# EAGLE design two_pieceboard_1 (EAGLE 7.6.0)
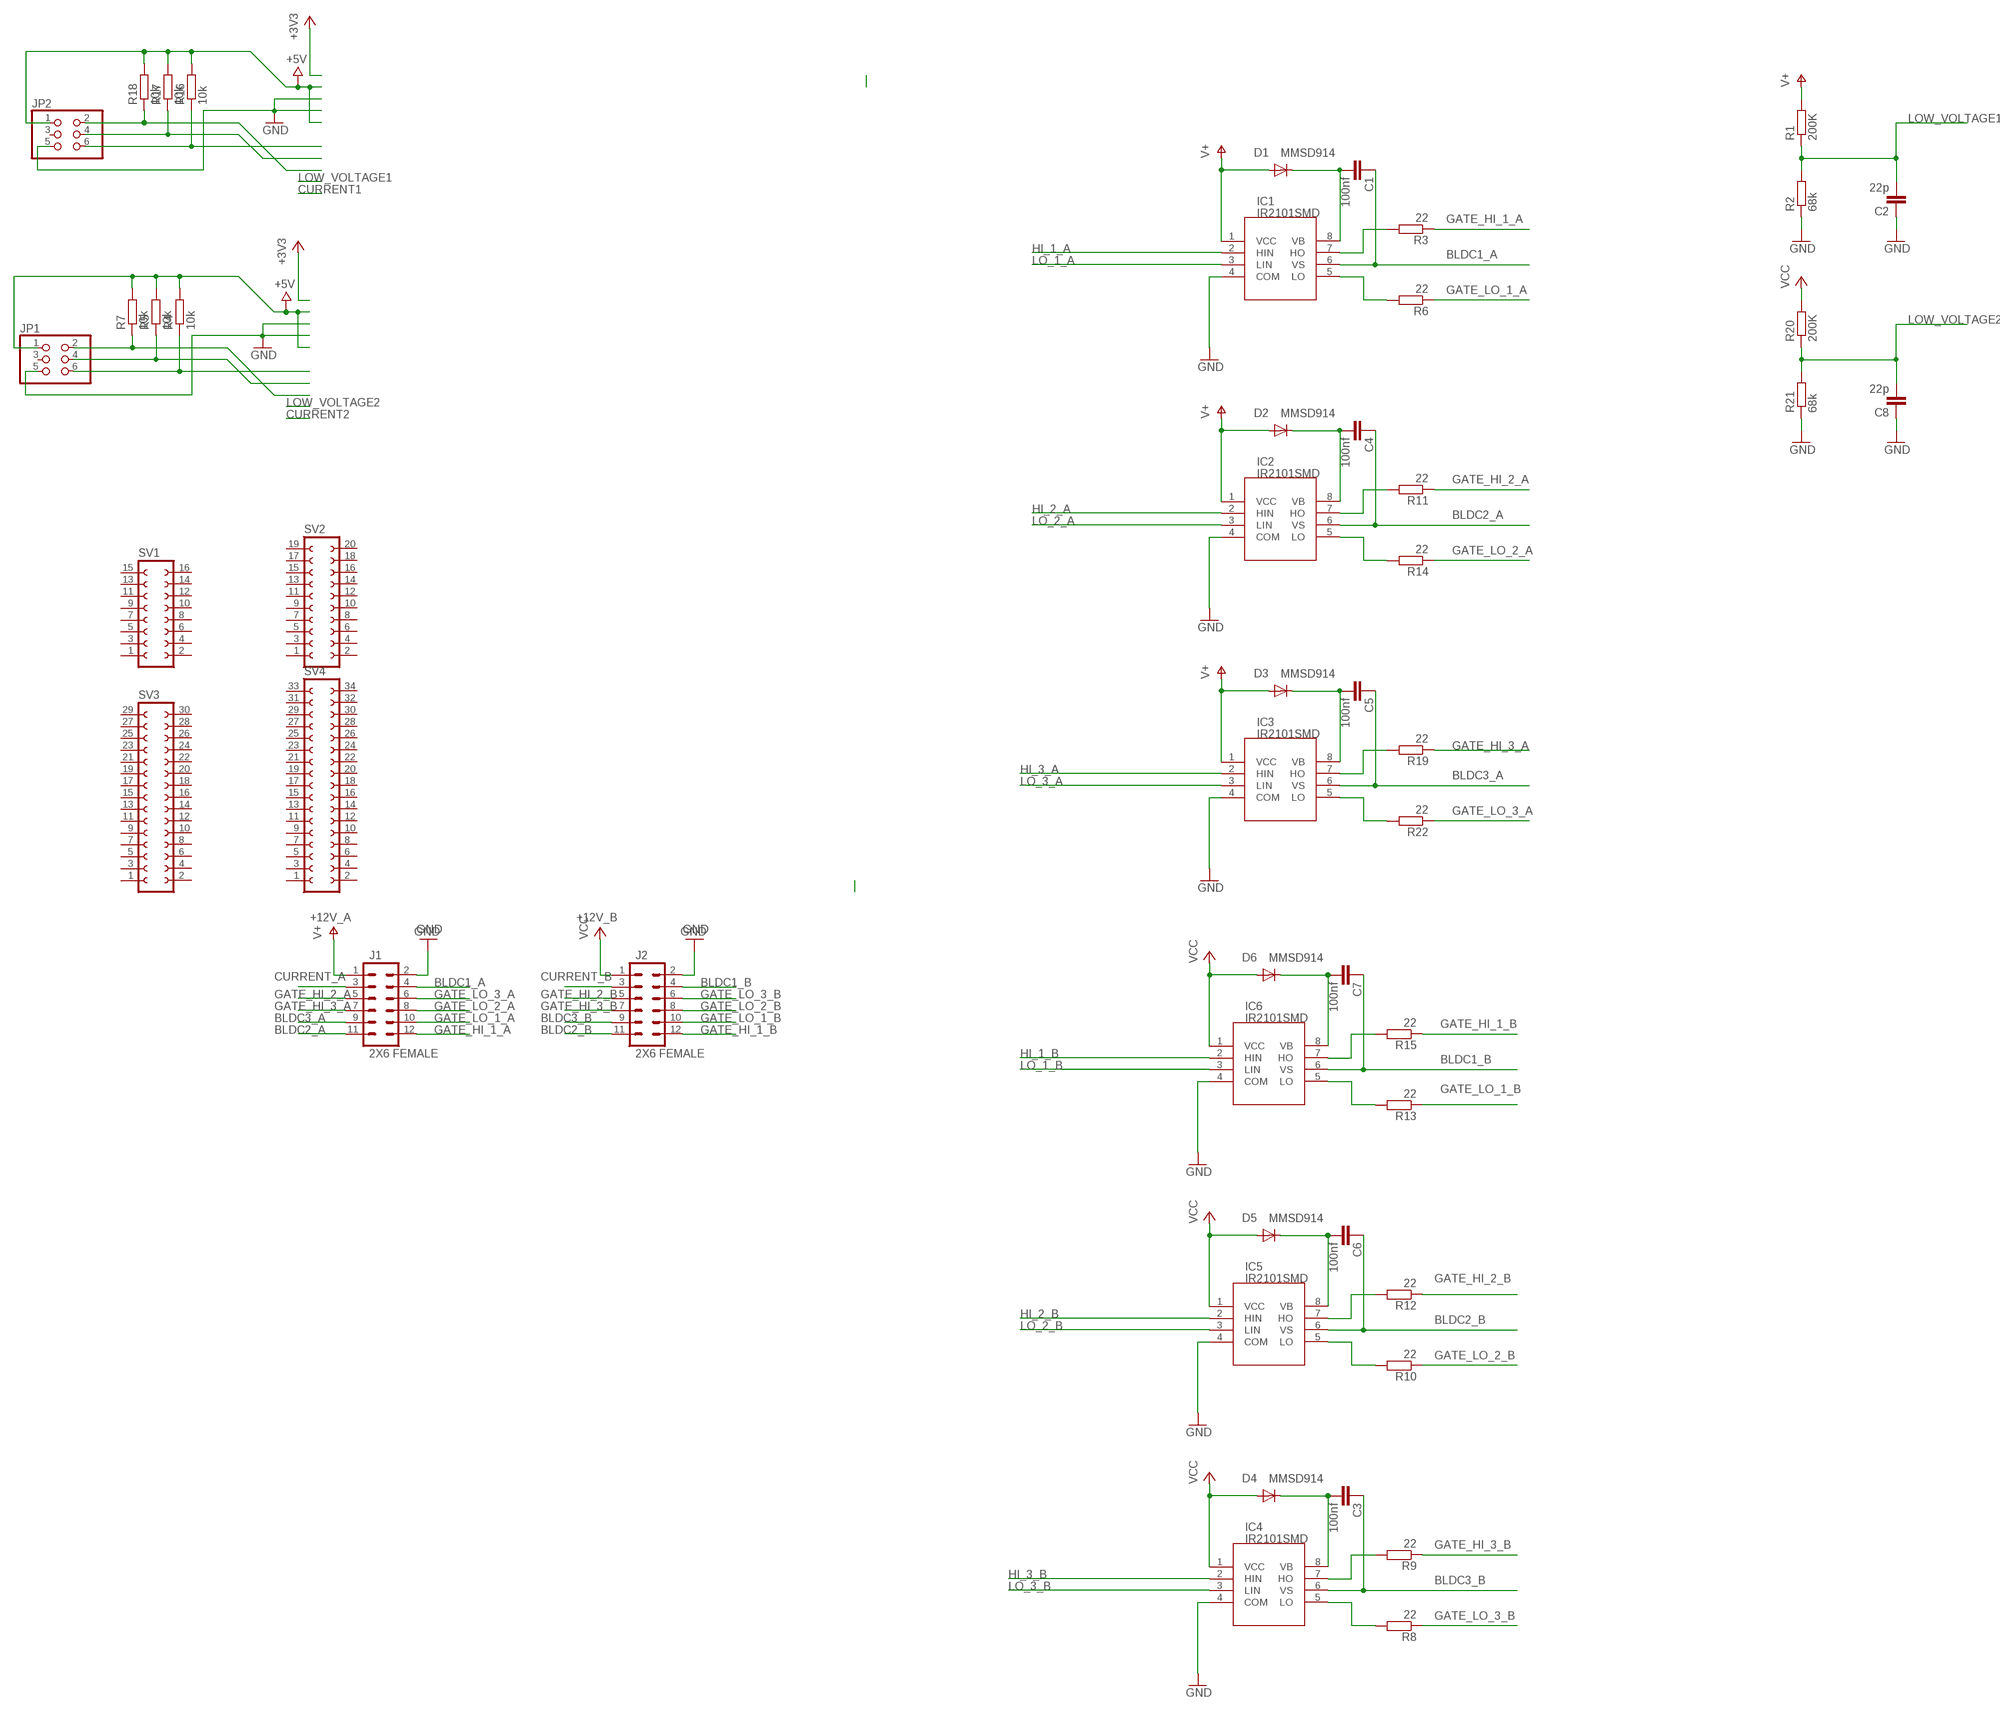
[diagram p0: schematic, sheet 1]

## Parts
C1  100nf  C-EUC1206  [C1206]
C2  22p  C-EUC1206  [C1206]
C3  100nf  C-EUC1206  [C1206]
C4  100nf  C-EUC1206  [C1206]
C5  100nf  C-EUC1206  [C1206]
C6  100nf  C-EUC1206  [C1206]
C7  100nf  C-EUC1206  [C1206]
C8  22p  C-EUC1206  [C1206]
D1  MMSD914  DIODE-SOD123  [SOD123]
D2  MMSD914  DIODE-SOD123  [SOD123]
D3  MMSD914  DIODE-SOD123  [SOD123]
D4  MMSD914  DIODE-SOD123  [SOD123]
D5  MMSD914  DIODE-SOD123  [SOD123]
D6  MMSD914  DIODE-SOD123  [SOD123]
IC1  IR2101SMD  [SO08]
IC2  IR2101SMD  [SO08]
IC3  IR2101SMD  [SO08]
IC4  IR2101SMD  [SO08]
IC5  IR2101SMD  [SO08]
IC6  IR2101SMD  [SO08]
J1  2X6 FEMALE  M06X2PTH_FEMALE  [2X6]
J2  2X6 FEMALE  M06X2PTH_FEMALE  [2X6]
JP1  PINHD-2X3  [2X03]
JP2  PINHD-2X3  [2X03]
R1  200K  R-EU_R1206  [R1206]
R2  68k  R-EU_R1206  [R1206]
R3  22  R-EU_R1206  [R1206]
R4  10k  R-EU_R1206  [R1206]
R5  10k  R-EU_R1206  [R1206]
R6  22  R-EU_R1206  [R1206]
R7  10k  R-EU_R1206  [R1206]
R8  22  R-EU_R1206  [R1206]
R9  22  R-EU_R1206  [R1206]
R10  22  R-EU_R1206  [R1206]
R11  22  R-EU_R1206  [R1206]
R12  22  R-EU_R1206  [R1206]
R13  22  R-EU_R1206  [R1206]
R14  22  R-EU_R1206  [R1206]
R15  22  R-EU_R1206  [R1206]
R16  10k  R-EU_R1206  [R1206]
R17  10k  R-EU_R1206  [R1206]
R18  10k  R-EU_R1206  [R1206]
R19  22  R-EU_R1206  [R1206]
R20  200K  R-EU_R1206  [R1206]
R21  68k  R-EU_R1206  [R1206]
R22  22  R-EU_R1206  [R1206]
SV1  FE08-2  [FE08-2]
SV2  FE10-2  [FE10-2]
SV3  FE15-2  [FE15-2]
SV4  FE17-2  [FE17-2]

## Nets
+5V [usbvcc]: JP1.1 JP2.1 R4.2 R5.2 R7.2 R16.2 R17.2 R18.2
+12V_A: D1.A D2.A D3.A IC1.1(VCC) IC2.1(VCC) IC3.1(VCC) J1.1 R1.2 ; supply symbol labelled V+
+12V_B: D4.A D5.A D6.A IC4.1(VCC) IC5.1(VCC) IC6.1(VCC) J2.1 R20.2 ; supply symbol labelled VCC
BLDC1_A: C1.1 IC1.6(VS) J1.4
BLDC1_B: C7.1 IC6.6(VS) J2.4
BLDC2_A: C4.1 IC2.6(VS) J1.11
BLDC2_B: C6.1 IC5.6(VS) J2.11
BLDC3_A: C5.1 IC3.6(VS) J1.9
BLDC3_B: C3.1 IC4.6(VS) J2.9
CURRENT_A: J1.3
CURRENT_B: J2.3
GATE_HI_1_A: J1.12 R3.1
GATE_HI_1_B: J2.12 R15.1
GATE_HI_2_A: J1.5 R11.1
GATE_HI_2_B: J2.5 R12.1
GATE_HI_3_A: J1.7 R19.1
GATE_HI_3_B: J2.7 R9.1
GATE_LO_1_A: J1.10 R6.1
GATE_LO_1_B: J2.10 R13.1
GATE_LO_2_A: J1.8 R14.1
GATE_LO_2_B: J2.8 R10.1
GATE_LO_3_A: J1.6 R22.1
GATE_LO_3_B: J2.6 R8.1
GND [gnd]: C2.1 C8.1 IC1.4(COM) IC2.4(COM) IC3.4(COM) IC4.4(COM) IC5.4(COM) IC6.4(COM) J1.2 J2.2 JP1.5 JP2.5 R2.1 R21.1
HI_1_A: IC1.2(HIN)
HI_1_B: IC6.2(HIN)
HI_2_A: IC2.2(HIN)
HI_2_B: IC5.2(HIN)
HI_3_A: IC3.2(HIN)
HI_3_B: IC4.2(HIN)
LO_1_A: IC1.3(LIN)
LO_1_B: IC6.3(LIN)
LO_2_A: IC2.3(LIN)
LO_2_B: IC5.3(LIN)
LO_3_A: IC3.3(LIN)
LO_3_B: IC4.3(LIN)
LOW_VOLTAGE1: C2.2 R1.1 R2.2
LOW_VOLTAGE2: C8.2 R20.1 R21.2
N$4: JP1.2 R7.1
N$7 [usbvcc]: JP1.6 R4.1
N$8: IC4.7(HO) R9.2
N$10 [usbvcc]: JP1.4 R5.1
N$12: IC4.5(LO) R8.2
N$13: IC3.7(HO) R19.2
N$16: IC3.5(LO) R22.2
N$17 [usbvcc]: C5.2 D3.C IC3.8(VB)
N$18 [usbvcc]: C3.2 D4.C IC4.8(VB)
N$19: IC5.7(HO) R12.2
N$21: IC2.7(HO) R11.2
N$22: IC5.5(LO) R10.2
N$24: IC2.5(LO) R14.2
N$25 [usbvcc]: C4.2 D2.C IC2.8(VB)
N$26 [usbvcc]: C6.2 D5.C IC5.8(VB)
N$27: IC6.7(HO) R15.2
N$29: IC1.7(HO) R3.2
N$30: IC6.5(LO) R13.2
N$32: IC1.5(LO) R6.2
N$33 [usbvcc]: C1.2 D1.C IC1.8(VB)
N$34 [usbvcc]: C7.2 D6.C IC6.8(VB)
N$39 [usbvcc]: JP2.6 R16.1
N$40 [usbvcc]: JP2.4 R17.1
N$41: JP2.2 R18.1
Unconnected: JP1.3 JP2.3 SV1.1 SV1.2 SV1.3 SV1.4 SV1.5 SV1.6 SV1.7 SV1.8 SV1.9 SV1.10 SV1.11 SV1.12 SV1.13 SV1.14 SV1.15 SV1.16 SV2.1 SV2.2 SV2.3 SV2.4 SV2.5 SV2.6 SV2.7 SV2.8 SV2.9 SV2.10 SV2.11 SV2.12 SV2.13 SV2.14 SV2.15 SV2.16 SV2.17 SV2.18 SV2.19 SV2.20 SV3.1 SV3.2 SV3.3 SV3.4 SV3.5 SV3.6 SV3.7 SV3.8 SV3.9 SV3.10 SV3.11 SV3.12 SV3.13 SV3.14 SV3.15 SV3.16 SV3.17 SV3.18 SV3.19 SV3.20 SV3.21 SV3.22 SV3.23 SV3.24 SV3.25 SV3.26 SV3.27 SV3.28 SV3.29 SV3.30 SV4.1 SV4.2 SV4.3 SV4.4 SV4.5 SV4.6 SV4.7 SV4.8 SV4.9 SV4.10 SV4.11 SV4.12 SV4.13 SV4.14 SV4.15 SV4.16 SV4.17 SV4.18 SV4.19 SV4.20 SV4.21 SV4.22 SV4.23 SV4.24 SV4.25 SV4.26 SV4.27 SV4.28 SV4.29 SV4.30 SV4.31 SV4.32 SV4.33 SV4.34

## Library data of the parts
C1-C8 = SmartPrj:C-EU: CAPACITOR, European symbol
D1-D6 = diode:DIODE-: DIODE
IC1-IC6 = IR:IR2101
J1 J2 = SparkFun-Connectors:M06X2; PROD_ID: CONN-12423
JP1 JP2 = SparkFun-Connectors:PINHD-2X3: PIN HEADER
R1-R22 = SmartPrj:R-EU_: RESISTOR, European symbol
SV1 = con-lsta:FE08-2: FEMALE HEADER; OC_FARNELL: unknown; OC_NEWARK: unknown
SV2 = con-lsta:FE10-2: FEMALE HEADER; OC_FARNELL: unknown; OC_NEWARK: unknown
SV3 = con-lsta:FE15-2: FEMALE HEADER; OC_FARNELL: unknown; OC_NEWARK: unknown
SV4 = con-lsta:FE17-2: FEMALE HEADER; OC_FARNELL: unknown; OC_NEWARK: unknown

## Net classes
0 default: width 0.254 mm, drill 0.61 mm, clearance 0.203 mm
2 gnd: width 0.254 mm, drill 0.61 mm, clearance 0.254 mm
3 usbvcc: width 0.254 mm, drill 0.61 mm, clearance 0.254 mm

## Board
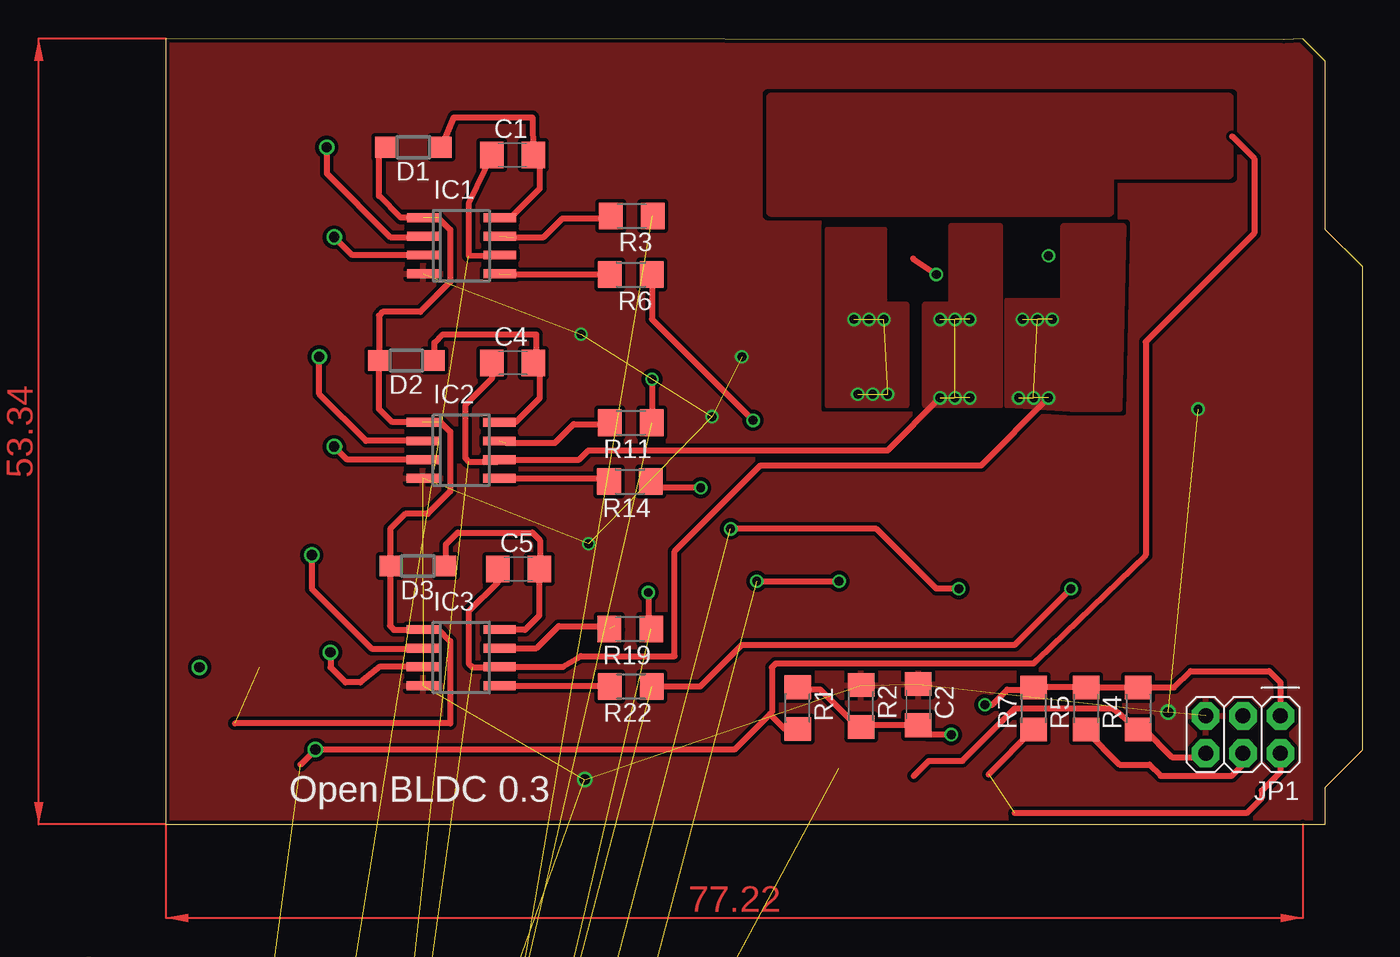
[diagram p1: board, top side]
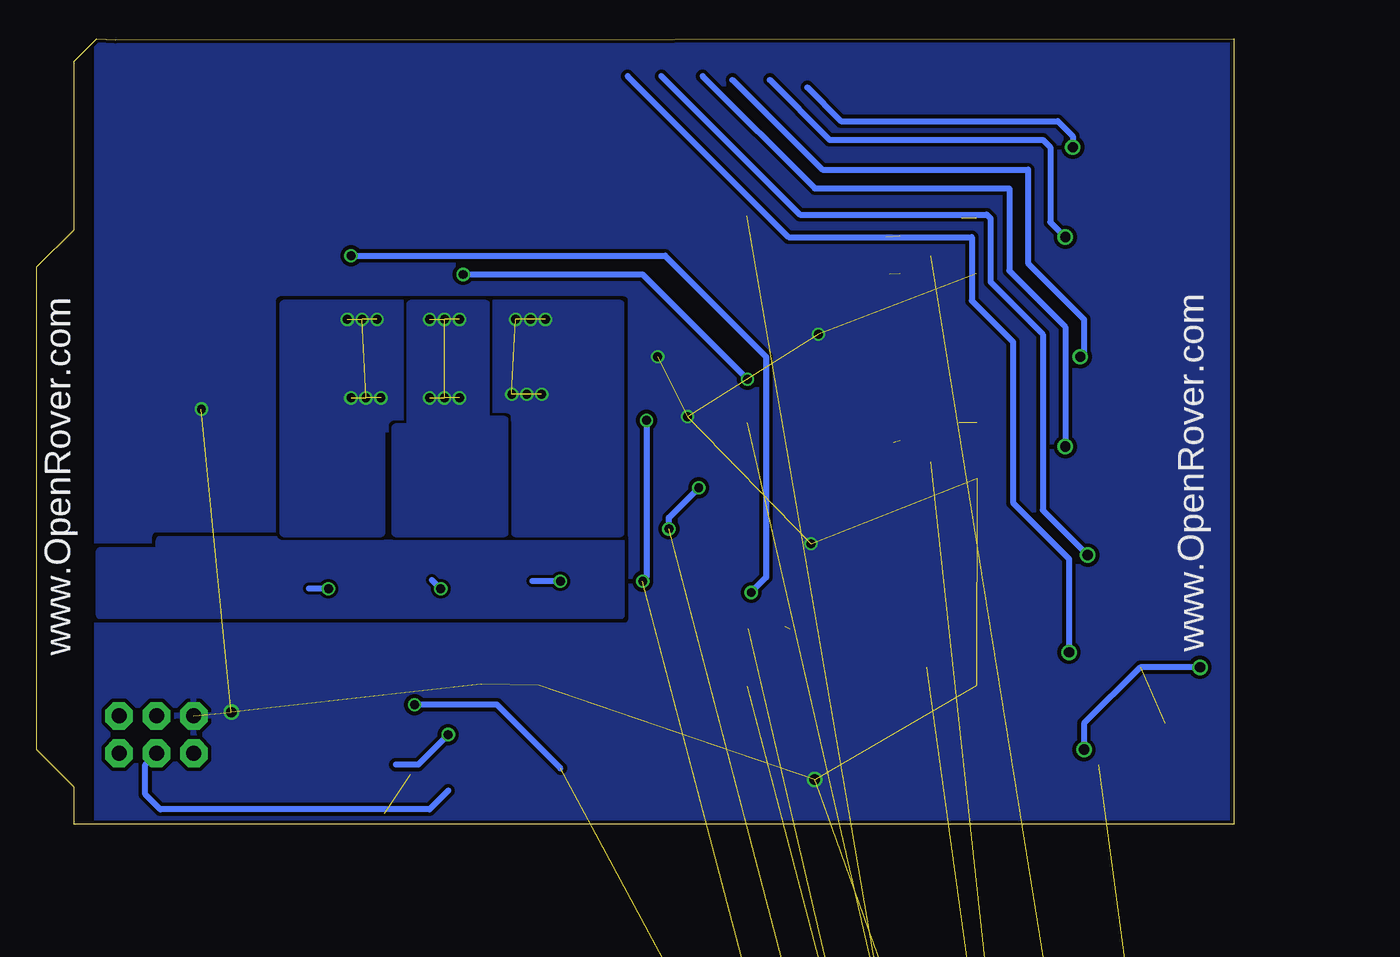
[diagram p2: board, bottom side, seen from below]

Size 81.28 x 53.34 mm. Coordinates in mm from the lower left corner, seen from the top.
Outline: 0,0 78.74,0 78.74,2.54 81.28,5.08 81.28,37.85 78.74,40.39 78.74,51.82 77.22,53.34 75.93,53.26 0,53.34 0,0
Copper layers (1*16): Top 0.035mm / dielectric 1.5mm / Bottom 0.035mm
Design rules "dirt_cheap_dirty_boards.v1": minimum track width 5mil, minimum drill 12mil, track to track 5mil, track to pad 5mil, pad to pad 5mil, via to via 5mil, smd to smd 0mil, copper to edge 10mil, drill to drill 10mil, minimum pad ring 10mil, minimum via ring 6mil, stop-mask expansion 2mil, vias tented up to drill 25mil, thermal gap 10mil

### Footprints (pad centres in the part's own frame; a part is rotated, then mirrored left to right if it is on the bottom)
C1206 = smd 1.6 x 1.8: 1 -1.4,0; 2 1.4,0
SOD123 = smd 1.4 x 1.4: A 1.9,0; C -1.9,0
SO08 = smd 0.6 x 2.2: 1 -1.905,-2.6; 2 -0.635,-2.6; 3 0.635,-2.6; 4 1.905,-2.6; 5 1.905,2.6; 6 0.635,2.6; 7 -0.635,2.6; 8 -1.905,2.6
2X6 = drill 1.016 pad 1.88 octagon: 1 0,0; 2 0,2.54; 3 2.54,0; 4 2.54,2.54; 5 5.08,0; 6 5.08,2.54; 7 7.62,0; 8 7.62,2.54; 9 10.16,0; 10 10.16,2.54; 11 12.7,0; 12 12.7,2.54
2X03 = drill 1.016 pad 1.88 octagon: 1 -2.54,-1.27; 2 -2.54,1.27; 3 0,-1.27; 4 0,1.27; 5 2.54,-1.27; 6 2.54,1.27
R1206 = smd 1.6 x 1.803: 1 -1.422,0; 2 1.422,0
FE08-2 = drill 0.914 octagon: 1 -8.89,1.27; 2 -8.89,-1.27; 3 -6.35,1.27; 4 -6.35,-1.27; 5 -3.81,1.27; 6 -3.81,-1.27; 7 -1.27,1.27; 8 -1.27,-1.27; 9 1.27,1.27; 10 1.27,-1.27; 11 3.81,1.27; 12 3.81,-1.27; 13 6.35,1.27; 14 6.35,-1.27; 15 8.89,1.27; 16 8.89,-1.27
FE10-2 = drill 0.914 octagon: 1 -11.43,1.27; 2 -11.43,-1.27; 3 -8.89,1.27; 4 -8.89,-1.27; 5 -6.35,1.27; 6 -6.35,-1.27; 7 -3.81,1.27; 8 -3.81,-1.27; 9 -1.27,1.27; 10 -1.27,-1.27; 11 1.27,1.27; 12 1.27,-1.27; 13 3.81,1.27; 14 3.81,-1.27; 15 6.35,1.27; 16 6.35,-1.27; 17 8.89,1.27; 18 8.89,-1.27; 19 11.43,1.27; 20 11.43,-1.27
FE15-2 = drill 0.914: 1 -17.78,1.27 | drill 0.914 octagon: 2 -17.78,-1.27; 3 -15.24,1.27; 4 -15.24,-1.27; 5 -12.7,1.27; 6 -12.7,-1.27; 7 -10.16,1.27; 8 -10.16,-1.27; 9 -7.62,1.27; 10 -7.62,-1.27; 11 -5.08,1.27; 12 -5.08,-1.27; 13 -2.54,1.27; 14 -2.54,-1.27; 15 0,1.27; 16 0,-1.27; 17 2.54,1.27; 18 2.54,-1.27; 19 5.08,1.27; 20 5.08,-1.27; 21 7.62,1.27; 22 7.62,-1.27; 23 10.16,1.27; 24 10.16,-1.27; 25 12.7,1.27; 26 12.7,-1.27; 27 15.24,1.27; 28 15.24,-1.27; 29 17.78,1.27; 30 17.78,-1.27
FE17-2 = drill 0.914: 1 -20.32,1.27 | drill 0.914 octagon: 2 -20.32,-1.27; 3 -17.78,1.27; 4 -17.78,-1.27; 5 -15.24,1.27; 6 -15.24,-1.27; 7 -12.7,1.27; 8 -12.7,-1.27; 9 -10.16,1.27; 10 -10.16,-1.27; 11 -7.62,1.27; 12 -7.62,-1.27; 13 -5.08,1.27; 14 -5.08,-1.27; 15 -2.54,1.27; 16 -2.54,-1.27; 17 0,1.27; 18 0,-1.27; 19 2.54,1.27; 20 2.54,-1.27; 21 5.08,1.27; 22 5.08,-1.27; 23 7.62,1.27; 24 7.62,-1.27; 25 10.16,1.27; 26 10.16,-1.27; 27 12.7,1.27; 28 12.7,-1.27; 29 15.24,1.27; 30 15.24,-1.27; 31 17.78,1.27; 32 17.78,-1.27; 33 20.32,1.27; 34 20.32,-1.27

### Placement (x,y rotation side)
C1  23.54,45.45 0 top
C2  51.09,8.13 270 top
C3  1.02,-65.79 0 top  (outside the outline)
C4  23.55,31.34 0 top
C5  23.95,17.34 0 top
C6  7.37,-65.79 0 top  (outside the outline)
C7  13.72,-65.79 0 top  (outside the outline)
C8  -8.89,-121.41 0 top  (outside the outline)
D1  16.81,45.97 180 top
D2  16.34,31.5 180 top
D3  17.11,17.54 180 top
D4  -3.56,-84.07 0 top  (outside the outline)
D5  7.11,-84.07 0 top  (outside the outline)
D6  -8.89,-89.92 0 top  (outside the outline)
IC1  20.07,39.29 270 top
IC2  20.05,25.4 270 top
IC3  20.06,11.33 270 top
IC4  -6.6,-58.93 0 top  (outside the outline)
IC5  3.3,-58.93 0 top  (outside the outline)
IC6  -6.6,-71.37 0 top  (outside the outline)
J1  -9.65,-136.4 0 top  (outside the outline)
J2  -9.65,-156.21 0 top  (outside the outline)
JP1  73.15,6.1 180 top
JP2  -7.11,-97.79 0 top  (outside the outline)
R1  42.9,7.89 270 top
R2  47.22,8.04 270 top
R3  31.64,41.32 180 top
R4  66.04,7.87 90 top
R5  62.48,7.87 90 top
R6  31.58,37.32 180 top
R7  58.93,7.87 90 top
R8  -8.89,-78.23 0 top  (outside the outline)
R9  -3.81,-78.23 0 top  (outside the outline)
R10  1.27,-78.23 0 top  (outside the outline)
R11  31.58,27.27 180 top
R12  6.35,-78.23 0 top  (outside the outline)
R13  11.43,-78.23 0 top  (outside the outline)
R14  31.52,23.27 180 top
R15  -8.89,-84.07 0 top  (outside the outline)
R16  -8.89,-103.89 0 top  (outside the outline)
R17  -3.81,-103.89 0 top  (outside the outline)
R18  -8.89,-109.73 0 top  (outside the outline)
R19  31.54,13.27 180 top
R20  -8.89,-115.57 0 top  (outside the outline)
R21  -8.89,-127.25 0 top  (outside the outline)
R22  31.58,9.37 180 top
SV1  -0.76,-13.72 0 top  (outside the outline)
SV2  1.78,-24.13 0 top  (outside the outline)
SV3  8.13,-34.8 0 top  (outside the outline)
SV4  10.67,-45.21 0 top  (outside the outline)

### Tracks (layer width: path | path; a pad name or v marks a point on that pad's centre or on a via)
+5V  (via drill 0.6)  (4 unrouted)
  Top 0.406: JP1.1 75.69,9.65 74.93,10.41 69.6,10.41 68.48,9.3 R4.2 R5.2 R7.2 58.78,9.14 57.15,9.14 56.13,8.13 v55.63,8.13
  Bottom 0.406: 45.72,3.81 50.04,8.13 v55.63,8.13
+12V_A  (via drill 0.7)  (4 unrouted)
  Top 0.406: 18.67,27.3 19.3,26.67 19.3,22.61 17.78,21.08 16.26,21.08 15.24,20.07 15.24,17.57 D3.A 15.21,13.49 15.49,13.21 17.43,13.21 IC3.1 18.51,13.23 19.3,12.45 19.3,6.86 4.67,6.86 | IC2.1 15.37,27.3 14.48,28.19 14.48,31.45 D2.A 14.48,31.54 14.48,34.54 14.73,34.8 17.27,34.8 19.3,36.83 19.3,40.39 18.5,41.19 | IC1.1 15.96,41.19 14.48,42.67 14.48,45.54 D1.A | 9.14,4.06 v10.16,5.08 38.61,5.08 41.02,7.49 | 2.26,10.69 v2.29,10.67 | 72.42,46.71 73.91,45.21 73.91,40.13 66.55,32.77 66.55,18.29 59.18,11.18 58.93,10.92 41.4,10.92 41.15,10.67 41.15,7.62 41.02,7.49 | R1.2 42.05,6.47 41.02,7.49
  Bottom 0.406: v2.29,10.67 6.35,10.67 10.16,6.86 v10.16,5.08
+12V_B  (7 unrouted)
  pour Top: 72.14,49.28 41.15,49.28 41.15,41.66 64.01,41.66 64.01,44.2 72.14,44.2
BLDC1  (via drill 0.6)  (5 unrouted)
  other vias: 46.74,34.29 47.75,34.29 48.77,34.29 46.99,29.21 48.01,29.21 49.02,29.21
  pour Top: 44.96,40.39 48.77,40.39 48.77,35.31 50.29,35.31 50.29,28.45 44.96,28.45
  pour Bottom (rank 2): 41.66,35.31 50.29,35.31 50.29,27.69 48.77,27.69 48.77,19.81 41.66,19.81
BLDC1_A  (1 unrouted)
  Top 0.406: C1.1 20.57,42.16 20.57,38.61 IC1.6
BLDC1_B  (2 unrouted)
BLDC2_A  (via drill 0.6)  (6 unrouted)
  Top 0.406: C4.1 22.15,30.28 20.32,28.45 20.32,24.89 20.57,24.64 22.52,24.64 IC2.6 28.07,24.77 28.7,25.4 49.02,25.4 v52.58,28.96
  other vias: 52.58,34.29 53.59,34.29 54.61,34.29 53.59,28.96 54.61,28.96
  pour Top: 53.34,40.64 56.64,40.64 56.64,28.45 51.56,28.45 51.56,35.31 53.34,35.31
  pour Bottom: 50.8,35.31 55.88,35.31 55.88,26.92 56.9,26.92 56.9,19.81 49.53,19.81 49.53,27.43 50.8,27.43
BLDC2_B  (2 unrouted)
BLDC3_A  (via drill 0.6)  (6 unrouted)
  Top 0.406: C5.1 22.55,16.45 20.57,14.48 20.57,10.92 20.83,10.67 22.63,10.67 IC3.6 26.95,10.7 28.19,11.43 34.54,11.43 34.54,18.54 40.39,24.38 55.37,24.38 v59.94,28.96
  other vias: 58.17,34.29 59.18,34.29 60.2,34.29 57.91,28.96 58.93,28.96
  pour Bottom (rank 2): 56.39,35.31 64.52,35.31 64.52,19.81 57.91,19.81 57.91,26.92 56.39,26.92
  pour Top: 60.96,40.64 65.02,40.64 64.77,28.19 61.47,28.19 57.15,28.45 57.15,35.56 60.96,35.56
BLDC3_B  (2 unrouted)
CURRENT2
  pour Bottom (rank 3): 41.66,19.3 41.66,14.22 76.96,14.22 76.96,18.54 72.9,18.54 72.9,19.3
GATE_HI_1_A  (1 unrouted)
GATE_HI_1_B  (1 unrouted)
GATE_HI_2_A  (via drill 0.6)  (1 unrouted)
  Top 0.406: 50.75,38.41 v52.32,37.34 | v33.02,30.23 33.02,27.29 R11.1
  Bottom 0.406: v52.32,37.34 40.13,37.34 v33.02,30.23
GATE_HI_2_B  (1 unrouted)
GATE_HI_3_A  (via drill 0.6)  (1 unrouted)
  Top 0.406: 59.74,38.41 v59.94,38.61 | v32.77,15.75 32.77,13.47 R19.1
  Bottom 0.406: v59.94,38.61 38.61,38.61 31.75,31.75 31.75,16.76 v32.77,15.75
GATE_HI_3_B  (1 unrouted)
GATE_LO_1_A  (via drill 0.6)  (1 unrouted)
  Top 0.406: R6.1 33,34.31 v39.88,27.43 | v40.13,16.51 v45.72,16.51
  Bottom 0.406: v39.88,27.43 39.88,16.76 v40.13,16.51 | v45.72,16.51 47.64,16.51
GATE_LO_1_B  (1 unrouted)
GATE_LO_2_A  (via drill 0.6)  (1 unrouted)
  Top 0.406: v53.85,16 52.32,16 48.26,20.07 v38.35,20.07 | v36.32,22.86 33.35,22.86 R14.1
  Bottom 0.406: 54.46,16.61 v53.85,16 | v38.35,20.07 38.35,20.83 v36.32,22.86
GATE_LO_2_B  (1 unrouted)
GATE_LO_3_A  (via drill 0.6)  (1 unrouted)
  Top 0.406: R22.1 36.29,9.37 39.12,12.19 57.66,12.19 v61.47,16
  Bottom 0.406: v61.47,16 62.8,16
GATE_LO_3_B  (1 unrouted)
GND  (via drill 0.6, 0.7)  (20 unrouted)
  other vias: 28.45,3.05 70.1,28.19 68.07,7.62 28.19,33.27 28.7,19.05 39.12,31.75 37.08,27.69
  pour Top (rank 3): 0.25,53.09 0,0 77.47,0 77.72,-0.25 77.72,52.07 76.45,53.34 3.3,53.34
  pour Bottom (rank 6): 0,53.34 77.22,53.34 77.22,0 0,0
HI_1_A  (via drill 0.7)
  Top 0.406: v10.92,45.97 10.92,44.2 15.24,39.88 17.42,39.88 IC1.2
  Bottom 0.406: 28.96,50.04 26.67,47.75 11.94,47.75 10.92,46.74 v10.92,45.97
HI_2_A  (via drill 0.7)
  Top 0.406: IC2.2 13.59,26.03 10.41,29.21 v10.41,31.75
  Bottom 0.406: 34.04,50.55 27.94,44.45 13.97,44.45 13.97,38.1 10.16,34.29 10.16,32 v10.41,31.75
HI_3_A  (via drill 0.7)
  Top 0.406: v9.91,18.29 9.91,16 13.97,11.94 17.43,11.94 IC3.2
  Bottom 0.406: 38.86,50.8 29.46,41.4 16.76,41.4 16.51,41.15 16.51,36.83 12.95,33.27 12.95,21.34 v9.91,18.29
LO_1_A  (via drill 0.7)
  Top 0.406: IC1.3 12.65,38.66 v11.43,39.88
  Bottom 0.406: 31.5,50.55 27.43,46.48 12.95,46.48 12.45,45.97 12.45,40.89 v11.43,39.88
LO_2_A  (via drill 0.7)
  Top 0.406: 11.81,25.65 v11.43,25.65 12.32,24.77 IC2.3
  Bottom 0.406: 36.07,50.8 28.45,43.18 15.24,43.18 15.24,37.59 11.43,33.78 v11.43,25.65
LO_3_A  (via drill 0.7)
  Top 0.406: IC3.3 14.5,10.7 13.21,9.65 12.19,9.65 11.18,10.67 v11.18,11.68
  Bottom 0.406: 41.15,50.8 30.23,39.88 17.78,39.88 17.78,35.56 14.99,32.77 14.99,21.84 11.18,18.03 v11.18,11.68
LOW_VOLTAGE1  (via drill 0.6)
  Top 0.406: v53.34,6.1 51.73,6.1 C2.2 47.33,6.73 R2.2 46.98,6.62 44.45,9.14 43.07,9.14 R1.1
  Bottom 0.406: v53.34,6.1 55.37,4.06 56.9,4.06
LOW_VOLTAGE2  (2 unrouted)
N$4  (1 unrouted)
  Top 0.406: JP1.2 75.69,3.56 74.42,2.29 74.42,1.78 73.41,0.76 57.66,0.76 | 55.88,3.4 R7.1
N$7
  Top 0.406: JP1.6 70.36,4.57 68.33,4.57 66.45,6.45 R4.1 64.52,7.72 64.26,7.87 57.66,7.87 54.1,4.32 51.82,4.32 50.8,3.3
N$8  (1 unrouted)
N$10
  Top 0.406: R5.1 62.48,6.35 64.77,4.06 66.8,4.06 67.56,3.3 72.39,3.3 73.15,4.06 JP1.4
  Bottom 0.406: 53.34,2.29 54.61,1.02 72.9,1.02 73.91,2.03 73.91,4.06 JP1.4
N$12  (1 unrouted)
N$13  (1 unrouted)
  Top 0.406: IC3.7 25.17,11.96 26.67,13.46 30.48,13.46 30.73,13.21
N$16
  Top 0.406: IC3.5 30.1,9.42 R22.2
N$17
  Top 0.406: IC3.8 22.69,13.21 24.38,13.21 25.35,14.17 C5.2 25.4,17.39 25.4,19.3 24.89,19.81 19.81,19.81 19.01,19.01 D3.C
N$18  (2 unrouted)
N$19  (1 unrouted)
N$21  (1 unrouted)
  Top 0.406: 23.11,25.91 26.42,25.91 27.69,27.18 30.07,27.18 R11.2
N$22  (1 unrouted)
N$24
  Top 0.406: IC2.5 29.87,23.49 R14.2
N$25
  Top 0.406: IC2.8 23.75,27.3 25.4,28.96 25.4,30.89 C4.2 25.15,31.54 25.15,33.27 18.8,33.27 18.24,32.71 D2.C
N$26  (2 unrouted)
N$27  (1 unrouted)
N$29  (1 unrouted)
  Top 0.406: 23.62,39.88 25.65,39.88 26.92,41.15 30.05,41.15 R3.2
N$30  (1 unrouted)
N$32  (1 unrouted)
  Top 0.406: 23.39,37.32 23.37,37.34 30.14,37.34 R6.2
N$33
  Top 0.406: IC1.8 23.41,41.19 25.4,43.18 25.4,44.99 C1.2 24.89,48.01 19.56,48.01 D1.C
N$34  (2 unrouted)
N$39  (1 unrouted)
N$40  (1 unrouted)
N$41  (1 unrouted)
(copper drawn outside any net)
  shapes: Top area x2

### Text on the board
tPlace: Open BLDC 0.3
bPlace: www.OpenRover.com | www.OpenRover.com